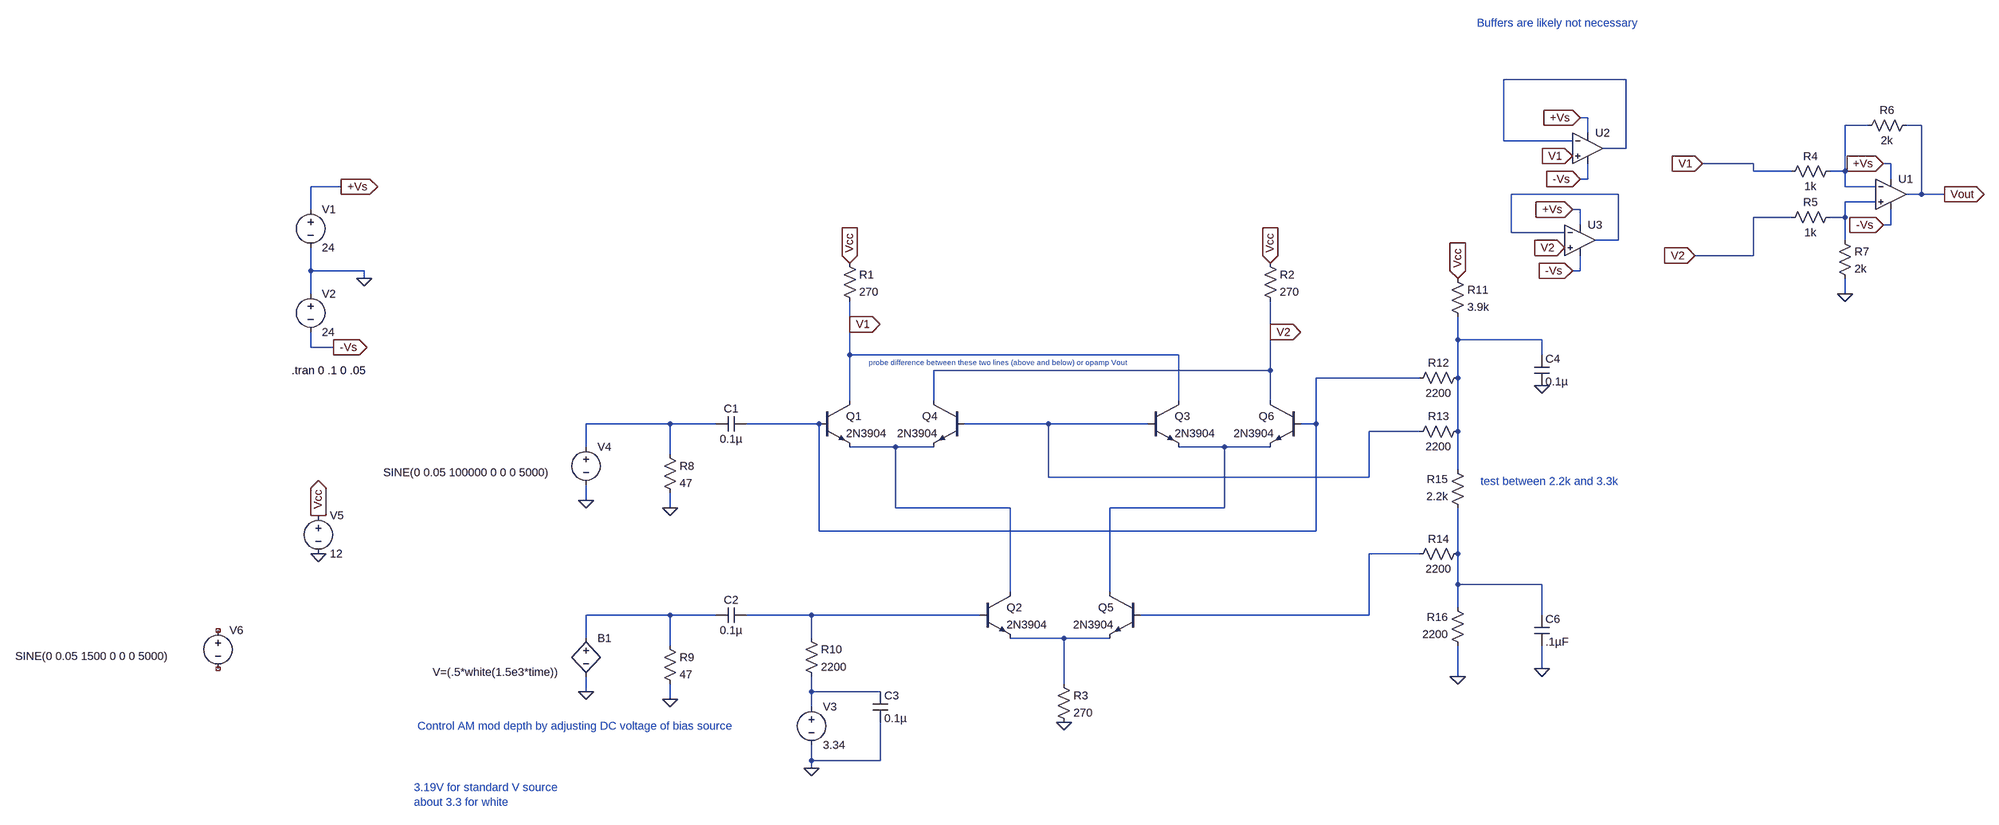
[diagram p0: schematic gilbertcell_TEST_V1.asc]
gilbertcell_TEST_V1.asc, the LTspice schematic file:
Version 4
SHEET 1 5444 900
WIRE 1584 -624 1328 -624
WIRE 1504 -544 1488 -544
WIRE 2112 -528 2064 -528
WIRE 2224 -528 2192 -528
WIRE 1504 -512 1504 -544
WIRE 1328 -496 1328 -624
WIRE 1472 -496 1328 -496
WIRE 1584 -480 1584 -624
WIRE 1584 -480 1536 -480
WIRE 1872 -448 1744 -448
WIRE 2160 -448 2144 -448
WIRE 1872 -432 1872 -448
WIRE 1952 -432 1872 -432
WIRE 2064 -432 2064 -528
WIRE 2064 -432 2032 -432
WIRE 1504 -416 1504 -448
WIRE 1504 -416 1488 -416
WIRE 2160 -416 2160 -448
WIRE -1184 -400 -1248 -400
WIRE 2064 -400 2064 -432
WIRE 2128 -400 2064 -400
WIRE 1568 -384 1344 -384
WIRE 2224 -384 2224 -528
WIRE 2224 -384 2192 -384
WIRE 2272 -384 2224 -384
WIRE 2128 -368 2064 -368
WIRE -1248 -352 -1248 -400
WIRE 1488 -352 1472 -352
WIRE 1952 -336 1872 -336
WIRE 2064 -336 2064 -368
WIRE 2064 -336 2032 -336
WIRE 1488 -320 1488 -352
WIRE 2160 -320 2160 -352
WIRE 2160 -320 2144 -320
WIRE 1344 -304 1344 -384
WIRE 1456 -304 1344 -304
WIRE 1568 -288 1568 -384
WIRE 1568 -288 1520 -288
WIRE 2064 -288 2064 -336
WIRE 1872 -256 1872 -336
WIRE 1872 -256 1728 -256
WIRE -1248 -224 -1248 -272
WIRE -1136 -224 -1248 -224
WIRE 1488 -224 1488 -256
WIRE 1488 -224 1472 -224
WIRE -1136 -208 -1136 -224
WIRE -1248 -176 -1248 -224
WIRE 2064 -176 2064 -208
WIRE -80 -112 -80 -160
WIRE 800 -96 800 -160
WIRE 1232 -80 1232 -128
WIRE 1408 -80 1232 -80
WIRE -1248 -64 -1248 -96
WIRE -1200 -64 -1248 -64
WIRE -80 -48 -80 -112
WIRE 608 -48 -80 -48
WIRE 1408 -48 1408 -80
WIRE 800 -16 800 -96
WIRE 800 -16 96 -16
WIRE 1152 0 896 0
WIRE 1232 0 1232 -80
WIRE -80 48 -80 -48
WIRE 96 48 96 -16
WIRE 608 48 608 -48
WIRE 800 48 800 -16
WIRE -496 96 -672 96
WIRE -400 96 -496 96
WIRE -144 96 -336 96
WIRE 336 96 160 96
WIRE 544 96 336 96
WIRE 896 96 896 0
WIRE 896 96 864 96
WIRE 1152 112 1040 112
WIRE 1232 112 1232 0
WIRE -672 144 -672 96
WIRE 16 144 -80 144
WIRE 96 144 16 144
WIRE 704 144 608 144
WIRE 800 144 704 144
WIRE -496 160 -496 96
WIRE 1232 192 1232 112
WIRE 336 208 336 96
WIRE 1040 208 1040 112
WIRE 1040 208 336 208
WIRE -672 256 -672 224
WIRE -496 272 -496 240
WIRE 16 272 16 144
WIRE 256 272 16 272
WIRE 704 272 704 144
WIRE 704 272 464 272
WIRE -144 320 -144 96
WIRE 896 320 896 96
WIRE 896 320 -144 320
WIRE 1152 368 1040 368
WIRE 1232 368 1232 272
WIRE 1232 432 1232 368
WIRE 1408 432 1232 432
WIRE 256 448 256 272
WIRE 464 448 464 272
WIRE 1232 480 1232 432
WIRE -496 496 -672 496
WIRE -400 496 -496 496
WIRE -160 496 -336 496
WIRE 192 496 -160 496
WIRE 1040 496 1040 368
WIRE 1040 496 528 496
WIRE 1408 496 1408 432
WIRE -672 544 -672 496
WIRE -160 544 -160 496
WIRE 368 544 256 544
WIRE 464 544 368 544
WIRE -496 560 -496 496
WIRE 1408 608 1408 560
WIRE 1232 624 1232 560
WIRE 368 640 368 544
WIRE -672 656 -672 624
WIRE -160 656 -160 624
WIRE -16 656 -160 656
WIRE -496 672 -496 640
WIRE -160 688 -160 656
WIRE -160 800 -160 768
WIRE -16 800 -16 720
WIRE -16 800 -160 800
WIRE -160 816 -160 800
FLAG 368 720 0
FLAG 2064 -176 0
FLAG 2272 -384 Vout
IOPIN 2272 -384 Out
FLAG 2144 -448 +Vs
IOPIN 2144 -448 In
FLAG 2144 -320 -Vs
IOPIN 2144 -320 In
FLAG -1184 -400 +Vs
IOPIN -1184 -400 Out
FLAG -1200 -64 -Vs
IOPIN -1200 -64 Out
FLAG -1136 -208 0
FLAG -672 256 0
FLAG -1232 288 Vcc
IOPIN -1232 288 Out
FLAG -1232 368 0
FLAG -80 -240 Vcc
IOPIN -80 -240 In
FLAG 800 -240 Vcc
IOPIN 800 -240 In
FLAG -496 272 0
FLAG -672 656 0
FLAG -496 672 0
FLAG -160 816 0
FLAG 1232 -208 Vcc
IOPIN 1232 -208 In
FLAG 1232 624 0
FLAG 1408 16 0
FLAG 1408 608 0
FLAG -80 -112 V1
IOPIN -80 -112 Out
FLAG 800 -96 V2
IOPIN 800 -96 Out
FLAG 1488 -544 +Vs
IOPIN 1488 -544 In
FLAG 1488 -416 -Vs
IOPIN 1488 -416 In
FLAG 1472 -352 +Vs
IOPIN 1472 -352 In
FLAG 1472 -224 -Vs
IOPIN 1472 -224 In
FLAG 1472 -464 V1
IOPIN 1472 -464 In
FLAG 1456 -272 V2
IOPIN 1456 -272 In
FLAG 1744 -448 V1
IOPIN 1744 -448 In
FLAG 1728 -256 V2
IOPIN 1728 -256 In
SYMBOL npn -144 48 R0
SYMATTR InstName Q1
SYMATTR Value 2N3904
SYMBOL npn 192 448 R0
SYMATTR InstName Q2
SYMATTR Value 2N3904
SYMBOL npn 544 48 R0
SYMATTR InstName Q3
SYMATTR Value 2N3904
SYMBOL npn 160 48 M0
SYMATTR InstName Q4
SYMATTR Value 2N3904
SYMBOL npn 528 448 M0
SYMATTR InstName Q5
SYMATTR Value 2N3904
SYMBOL npn 864 48 M0
SYMATTR InstName Q6
SYMATTR Value 2N3904
SYMBOL res -96 -256 R0
SYMATTR InstName R1
SYMATTR Value 270
SYMBOL res 784 -256 R0
SYMATTR InstName R2
SYMATTR Value 270
SYMBOL res 352 624 R0
SYMATTR InstName R3
SYMATTR Value 270
SYMBOL OpAmps\\UniversalOpAmp 2160 -384 R0
SYMATTR InstName U1
SYMBOL res 2048 -448 R90
WINDOW 0 0 56 VBottom 2
WINDOW 3 32 56 VTop 2
SYMATTR InstName R4
SYMATTR Value 1k
SYMBOL res 2048 -352 R90
WINDOW 0 0 56 VBottom 2
WINDOW 3 32 56 VTop 2
SYMATTR InstName R5
SYMATTR Value 1k
SYMBOL res 2208 -544 R90
WINDOW 0 0 56 VBottom 2
WINDOW 3 32 56 VTop 2
SYMATTR InstName R6
SYMATTR Value 2k
SYMBOL res 2048 -304 R0
SYMATTR InstName R7
SYMATTR Value 2k
SYMBOL voltage -1248 -368 R0
WINDOW 123 0 0 Left 0
WINDOW 39 0 0 Left 0
SYMATTR InstName V1
SYMATTR Value 24
SYMBOL voltage -1248 -192 R0
WINDOW 123 0 0 Left 0
WINDOW 39 0 0 Left 0
SYMATTR InstName V2
SYMATTR Value 24
SYMBOL voltage -672 128 R0
WINDOW 123 0 0 Left 0
WINDOW 39 0 0 Left 0
WINDOW 3 -424 70 Left 2
SYMATTR Value SINE(0 0.05 100000 0 0 0 5000)
SYMATTR InstName V4
SYMBOL voltage -1232 272 R0
WINDOW 123 0 0 Left 0
WINDOW 39 0 0 Left 0
SYMATTR InstName V5
SYMATTR Value 12
SYMBOL cap -336 80 R90
WINDOW 0 0 32 VBottom 2
WINDOW 3 32 32 VTop 2
SYMATTR InstName C1
SYMATTR Value 0.1µ
SYMBOL res -512 144 R0
SYMATTR InstName R8
SYMATTR Value 47
SYMBOL voltage -1472 512 R0
WINDOW 123 0 0 Left 0
WINDOW 39 0 0 Left 0
WINDOW 3 -424 70 Left 2
SYMATTR Value SINE(0 0.05 1500 0 0 0 5000)
SYMATTR InstName V6
SYMBOL cap -336 480 R90
WINDOW 0 0 32 VBottom 2
WINDOW 3 32 32 VTop 2
SYMATTR InstName C2
SYMATTR Value 0.1µ
SYMBOL res -512 544 R0
SYMATTR InstName R9
SYMATTR Value 47
SYMBOL res -176 528 R0
SYMATTR InstName R10
SYMATTR Value 2200
SYMBOL voltage -160 672 R0
WINDOW 123 0 0 Left 0
WINDOW 39 0 0 Left 0
SYMATTR InstName V3
SYMATTR Value 3.34
SYMBOL cap -32 656 R0
SYMATTR InstName C3
SYMATTR Value 0.1µ
SYMBOL res 1216 -224 R0
SYMATTR InstName R11
SYMATTR Value 3.9k
SYMBOL res 1248 -16 R90
WINDOW 0 0 56 VBottom 2
WINDOW 3 32 56 VTop 2
SYMATTR InstName R12
SYMATTR Value 2200
SYMBOL res 1248 96 R90
WINDOW 0 0 56 VBottom 2
WINDOW 3 32 56 VTop 2
SYMATTR InstName R13
SYMATTR Value 2200
SYMBOL res 1248 352 R90
WINDOW 0 0 56 VBottom 2
WINDOW 3 32 56 VTop 2
SYMATTR InstName R14
SYMATTR Value 2200
SYMBOL res 1248 288 R180
WINDOW 0 36 76 Left 2
WINDOW 3 36 40 Left 2
SYMATTR InstName R15
SYMATTR Value 2.2k
SYMBOL res 1248 576 R180
WINDOW 0 36 76 Left 2
WINDOW 3 36 40 Left 2
SYMATTR InstName R16
SYMATTR Value 2200
SYMBOL cap 1392 -48 R0
SYMATTR InstName C4
SYMATTR Value 0.1µ
SYMBOL cap 1392 496 R0
SYMATTR InstName C6
SYMATTR Value .1µF
SYMBOL bv -672 528 R0
WINDOW 3 -321 87 Left 2
SYMATTR Value V=(.5*white(1.5e3*time))
SYMATTR InstName B1
SYMBOL OpAmps\\UniversalOpAmp 1504 -480 R0
SYMATTR InstName U2
SYMBOL OpAmps\\UniversalOpAmp 1488 -288 R0
SYMATTR InstName U3
TEXT -1288 -16 Left 2 !.tran 0 .1 0 .05
TEXT 1280 216 Left 2 ;test between 2.2k and 3.3k
TEXT -40 -32 Left 1 ;probe difference between these two lines (above and below) or opamp Vout
TEXT -1024 728 Left 2 ;Control AM mod depth by adjusting DC voltage of bias source
TEXT -1032 856 Left 2 ;3.19V for standard V source\nabout 3.3 for white
TEXT 1272 -896 Left 2 ;Buffers are likely not necessary

The netlist it stands for:
* gilbertcell_TEST_V1.asc
Q1 V1 N006 N009 0 2N3904
Q2 N009 N014 N015 0 2N3904
Q3 V1 N008 N010 0 2N3904
Q4 V2 N008 N009 0 2N3904
Q5 N010 N011 N015 0 2N3904
Q6 V2 N006 N010 0 2N3904
R1 Vcc V1 270
R2 Vcc V2 270
R3 N015 0 270
XU1 N004 N002 +Vs -Vs Vout level1 Avol=1Meg GBW=10Meg Vos=0 En=0 Enk=0 In=0 Ink=0 Rin=500Meg  ; pins In+ In- V+ V- OUT
R4 N002 V1 1k
R5 N004 V2 1k
R6 Vout N002 2k
R7 N004 0 2k
V1 +Vs 0 24
V2 0 -Vs 24
V4 N007 0 SINE(0 0.05 100000 0 0 0 5000)
V5 Vcc 0 12
C1 N006 N007 0.1µ
R8 N007 0 47
V6 NC_01 NC_02 SINE(0 0.05 1500 0 0 0 5000)
C2 N014 N013 0.1µ
R9 N013 0 47
R10 N014 N016 2200
V3 N016 0 3.34
C3 N016 0 0.1µ
R11 Vcc N005 3.9k
R12 N005 N006 2200
R13 N005 N008 2200
R14 N012 N011 2200
R15 N012 N005 2.2k
R16 0 N012 2200
C4 N005 0 0.1µ
C6 N012 0 .1µF
B1 N013 0 V=(.5*white(1.5e3*time))
XU2 V1 N001 +Vs -Vs N001 level1 Avol=1Meg GBW=10Meg Vos=0 En=0 Enk=0 In=0 Ink=0 Rin=500Meg  ; pins In+ In- V+ V- OUT
XU3 V2 N003 +Vs -Vs N003 level1 Avol=1Meg GBW=10Meg Vos=0 En=0 Enk=0 In=0 Ink=0 Rin=500Meg  ; pins In+ In- V+ V- OUT
.model NPN NPN
.model PNP PNP
.lib standard.bjt
.tran 0 .1 0 .05
* test between 2.2k and 3.3k
* probe difference between these two lines (above and below) or opamp Vout
* Control AM mod depth by adjusting DC voltage of bias source
* 3.19V for standard V source
* about 3.3 for white
* Buffers are likely not necessary
.lib UniversalOpAmp1.lib
.backanno
.end